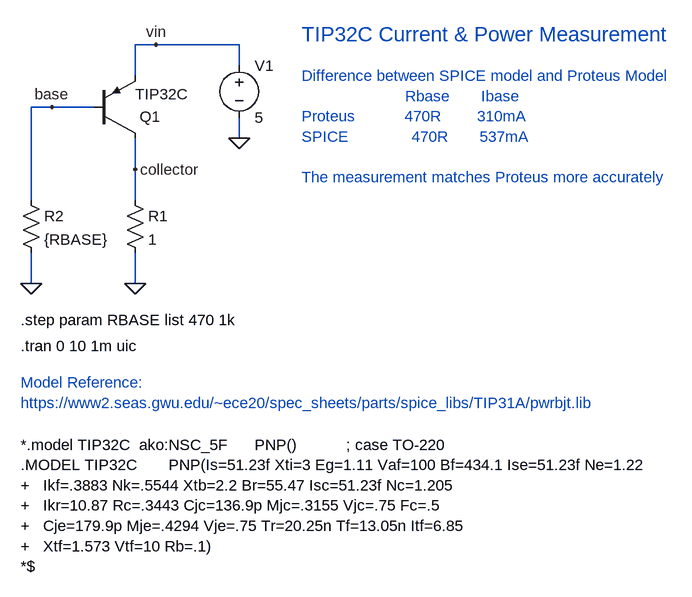
[diagram p0: schematic 01-tip32c_heater.asc]
01-tip32c_heater.asc, the LTspice schematic file:
Version 4
SHEET 1 1548 2356
WIRE 432 -592 400 -592
WIRE 560 -592 432 -592
WIRE 560 -560 560 -592
WIRE 400 -544 400 -592
WIRE 272 -496 240 -496
WIRE 336 -496 272 -496
WIRE 560 -448 560 -480
WIRE 400 -400 400 -448
WIRE 240 -352 240 -496
WIRE 400 -352 400 -400
WIRE 240 -224 240 -272
WIRE 400 -224 400 -272
FLAG 400 -224 0
FLAG 560 -448 0
FLAG 240 -224 0
FLAG 432 -592 vin
FLAG 400 -400 collector
FLAG 272 -496 base
SYMBOL pnp 336 -448 M180
WINDOW 0 71 33 Left 2
WINDOW 3 64 68 Left 2
SYMATTR InstName Q1
SYMATTR Value TIP32C
SYMBOL res 384 -368 R0
SYMATTR InstName R1
SYMATTR Value 1
SYMBOL voltage 560 -576 R0
WINDOW 123 0 0 Left 0
WINDOW 39 0 0 Left 0
SYMATTR InstName V1
SYMATTR Value 5
SYMBOL res 224 -368 R0
SYMATTR InstName R2
SYMATTR Value {RBASE}
TEXT 224 24 Left 2 !*.model TIP32C  ako:NSC_5F      PNP()           ; case TO-220\n.MODEL TIP32C       PNP(Is=51.23f Xti=3 Eg=1.11 Vaf=100 Bf=434.1 Ise=51.23f Ne=1.22\n+   Ikf=.3883 Nk=.5544 Xtb=2.2 Br=55.47 Isc=51.23f Nc=1.205\n+   Ikr=10.87 Rc=.3443 Cjc=136.9p Mjc=.3155 Vjc=.75 Fc=.5\n+   Cje=179.9p Mje=.4294 Vje=.75 Tr=20.25n Tf=13.05n Itf=6.85\n+   Xtf=1.573 Vtf=10 Rb=.1)\n*$
TEXT 224 -128 Left 2 !.tran 0 10 1m uic
TEXT 224 -168 Left 2 !.step param RBASE list 470 1k
TEXT 224 -72 Left 2 ;Model Reference:\nhttps://www2.seas.gwu.edu/~ece20/spec_sheets/parts/spice_libs/TIP31A/pwrbjt.lib
TEXT 656 -544 Left 2 ;Difference between SPICE model and Proteus Model\n                       Rbase       Ibase\nProteus           470R        310mA\nSPICE              470R       537mA\n \nThe measurement matches Proteus more accurately
TEXT 656 -608 Left 3 ;TIP32C Current & Power Measurement

The netlist it stands for:
* 01-tip32c_heater.asc
Q1 collector base vin 0 TIP32C
R1 collector 0 1
V1 vin 0 5
R2 base 0 {RBASE}
.model NPN NPN
.model PNP PNP
.lib standard.bjt
*.model TIP32C  ako:NSC_5F      PNP()           ; case TO-220
.MODEL TIP32C       PNP(Is=51.23f Xti=3 Eg=1.11 Vaf=100 Bf=434.1 Ise=51.23f Ne=1.22
+   Ikf=.3883 Nk=.5544 Xtb=2.2 Br=55.47 Isc=51.23f Nc=1.205
+   Ikr=10.87 Rc=.3443 Cjc=136.9p Mjc=.3155 Vjc=.75 Fc=.5
+   Cje=179.9p Mje=.4294 Vje=.75 Tr=20.25n Tf=13.05n Itf=6.85
+   Xtf=1.573 Vtf=10 Rb=.1)
*$
.tran 0 10 1m uic
.step param RBASE list 470 1k
* Model Reference:
* https://www2.seas.gwu.edu/~ece20/spec_sheets/parts/spice_libs/TIP31A/pwrbjt.lib
* Difference between SPICE model and Proteus Model
*                        Rbase       Ibase
* Proteus           470R        310mA
* SPICE              470R       537mA
* The measurement matches Proteus more accurately
* TIP32C Current & Power Measurement
.backanno
.end

* Results of the author's LTspice run, read from the files saved beside the schematic
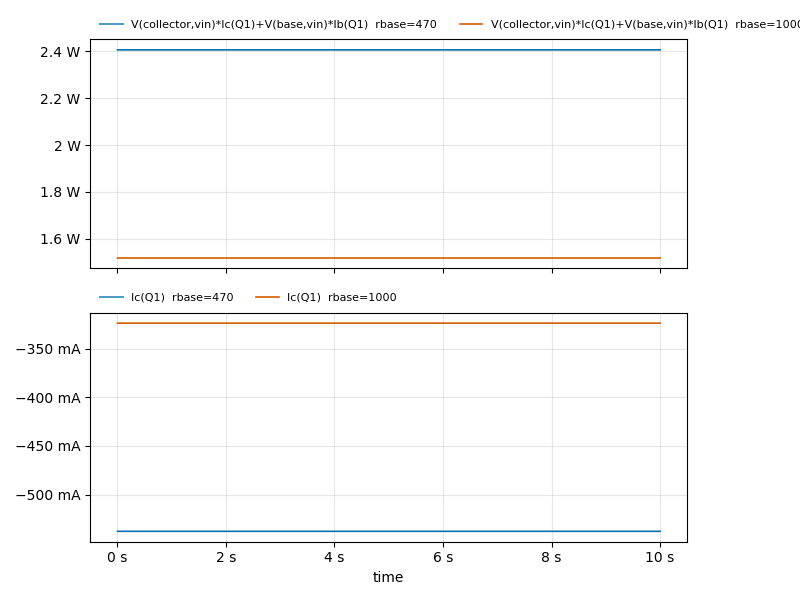
[diagram p1: Transient Analysis of 01-tip32c_heater.asc, plotted from the saved traces]
* Transient Analysis, 2 runs:
*   V(collector,vin)*Ic(Q1)+V(base,vin)*Ib(Q1) [rbase=470]: min 2.407 W, max 2.407 W, average 2.407 W, rms 2.407 W, last 2.407 W
*   V(collector,vin)*Ic(Q1)+V(base,vin)*Ib(Q1) [rbase=1000]: min 1.517 W, max 1.517 W, average 1.517 W, rms 1.517 W, last 1.517 W
*   Ic(Q1) [rbase=470]: min -537.8 mA, max -537.8 mA, average -537.8 mA, rms 537.8 mA, last -537.8 mA
*   Ic(Q1) [rbase=1000]: min -323.8 mA, max -323.8 mA, average -323.8 mA, rms 323.8 mA, last -323.8 mA